# Altium project PCB_Project.PrjPcb (part 2 of 2)
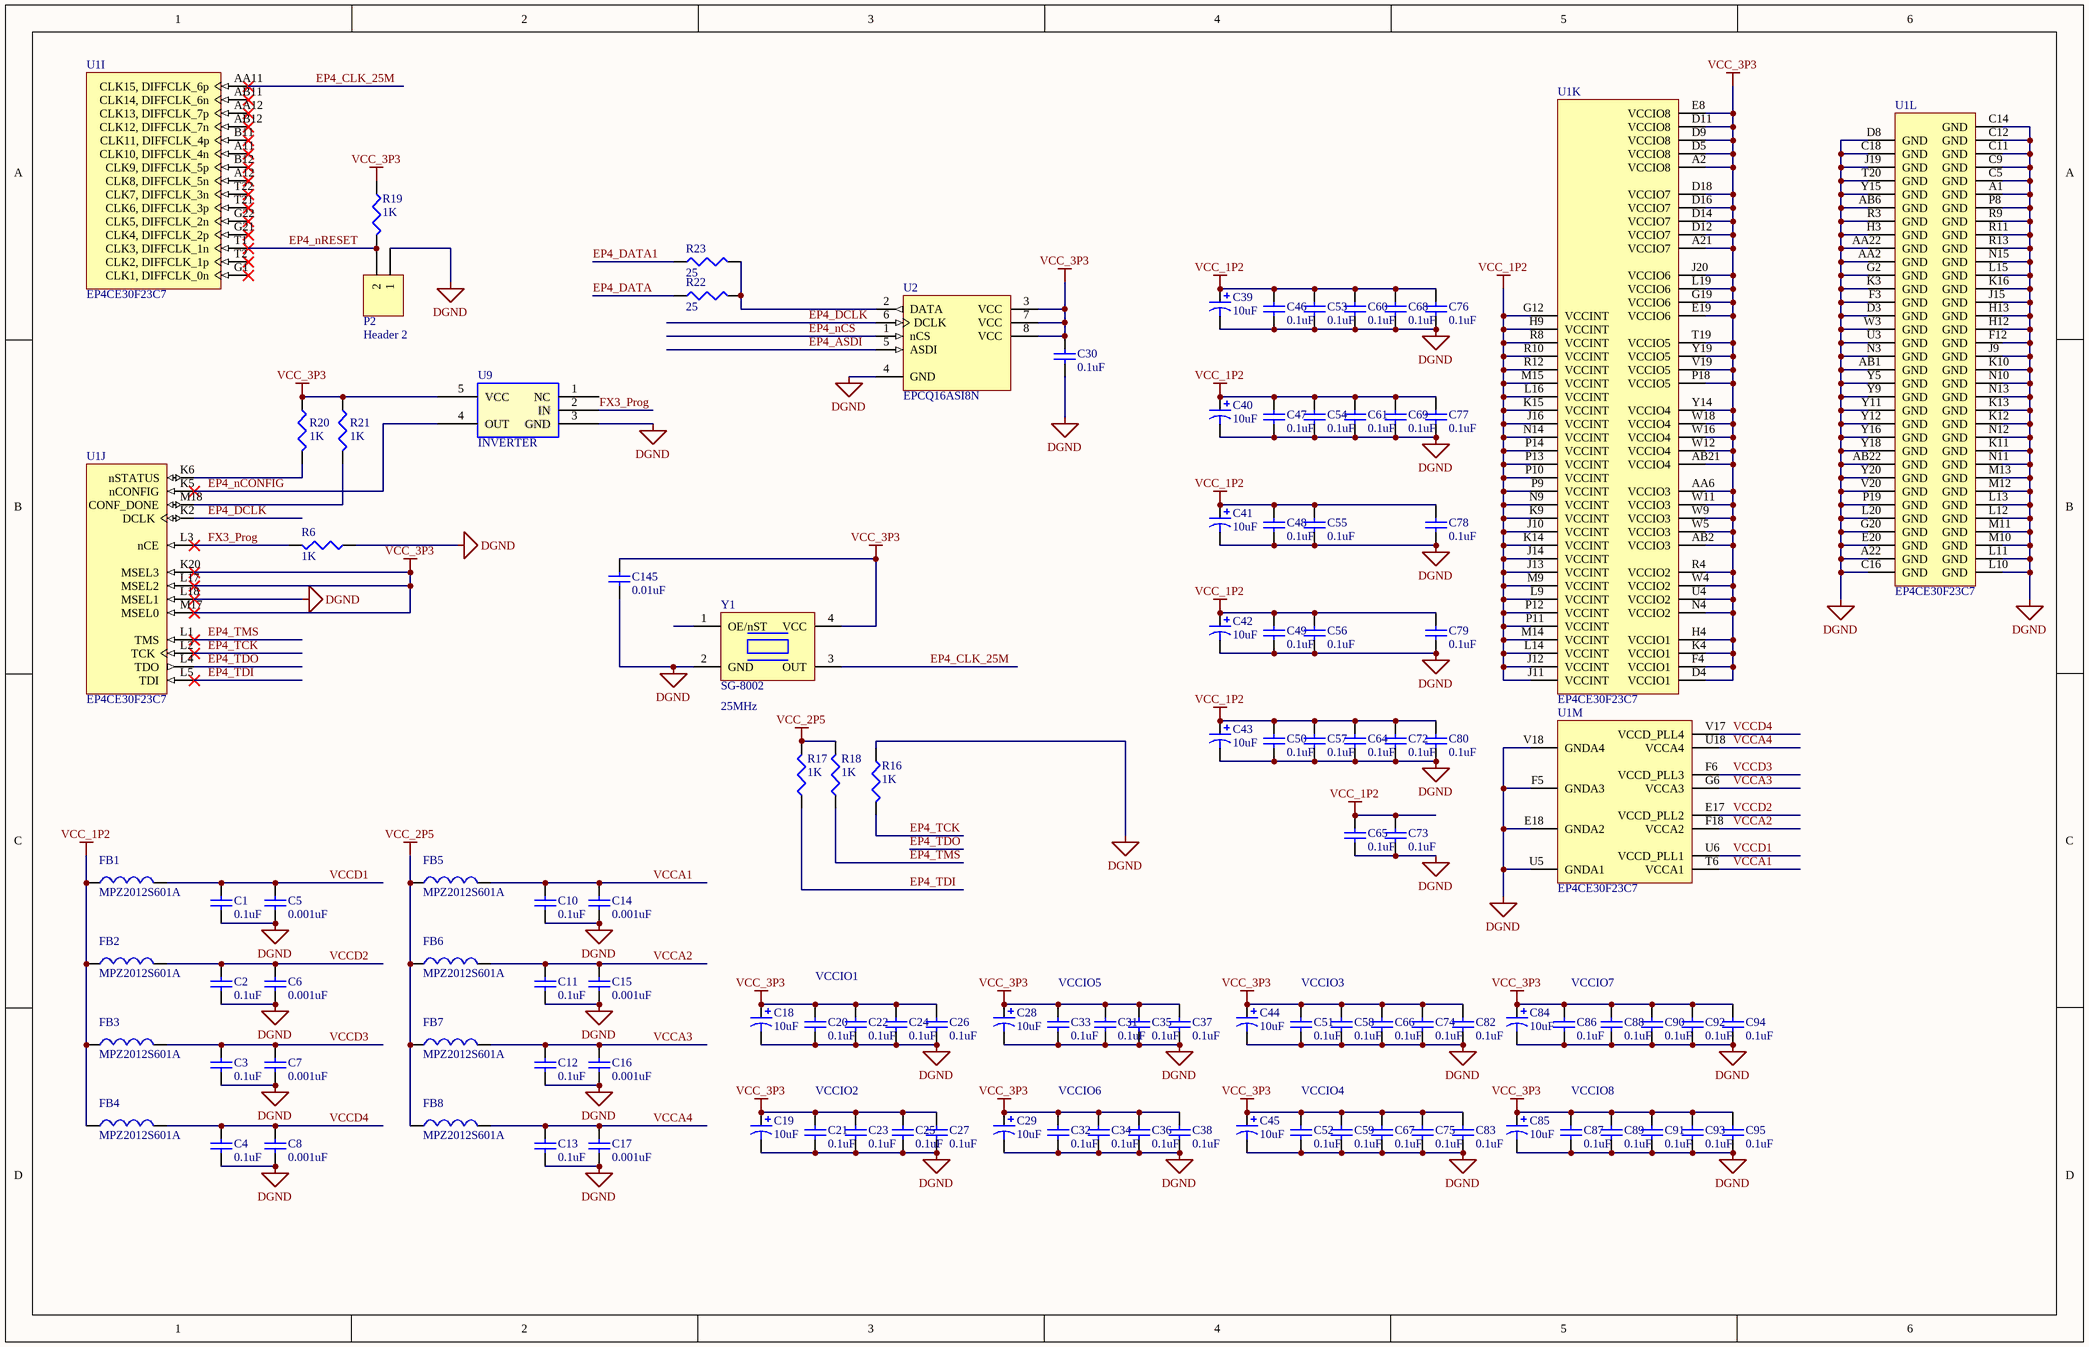
[diagram p6: ep4ce30_c.SchDoc]

## Nets that join several sheets
DGND: interface (51 pins), fx3_a (19 pins), fx3_b (51 pins), ep4ce30_c (168 pins)
VCC_1P2: interface (5 pins), fx3_b (21 pins), ep4ce30_c (60 pins)
VCC_2P5: interface (C251.1 J7.1 U27.5), ep4ce30_c (6 pins)
VCC_3P3: interface (24 pins), fx3_a (9 pins), fx3_b (24 pins), ep4ce30_c (93 pins)
VUSB: interface (P3.1), fx3_a (L1.2 U3.E11)
DIG_IN0: interface (U8.36), ep4ce30_b (U1.H21)
DIG_IN1: interface (U8.35), ep4ce30_b (U1.H22)
DIG_IN2: interface (U8.33), ep4ce30_b (U1.J21)
DIG_IN3: interface (U8.32), ep4ce30_b (U1.J22)
DIG_OUT0: interface (U8.47), ep4ce30_b (U1.C21)
DIG_OUT1: interface (U8.46), ep4ce30_b (U1.C22)
DIG_OUT2: interface (U8.44), ep4ce30_b (U1.D21)
DIG_OUT3: interface (U8.43), ep4ce30_b (U1.D22)
DIG_OUT4: interface (U8.41), ep4ce30_b (U1.E21)
DIG_OUT5: interface (U8.40), ep4ce30_b (U1.E22)
DIG_OUT6: interface (U8.38), ep4ce30_b (U1.F21)
DIG_OUT7: interface (U8.37), ep4ce30_b (U1.F22)
DIN0: interface (U8.26), ep4ce30_b (U1.L22)
DIN1: interface (U8.27), ep4ce30_b (U1.L21)
DIN2: interface (U8.29), ep4ce30_b (U1.K22)
DOUT0: interface (U7.47), ep4ce30_a (U1.AA17)
DOUT1: interface (U7.46), ep4ce30_a (U1.AB18)
DOUT2: interface (U7.44), ep4ce30_a (U1.AA18)
DOUT3: interface (U7.43), ep4ce30_a (U1.AB19)
DOUT4: interface (U7.40), ep4ce30_a (U1.AB20)
DOUT5: interface (U7.37), ep4ce30_b (U1.AA21)
DOUT6: interface (U7.35), ep4ce30_b (U1.Y21)
DOUT7: interface (U7.33), ep4ce30_b (U1.W22)
DOUT8: interface (U7.30), ep4ce30_b (U1.V22)
DOUT9: interface (U7.41), ep4ce30_a (U1.AA19)
DOUT10: interface (U7.38), ep4ce30_a (U1.AA20)
DOUT11: interface (U7.36), ep4ce30_b (U1.Y22)
DOUT12: interface (U7.32), ep4ce30_b (U1.W21)
DOUT13: interface (U7.27), ep4ce30_b (U1.U22)
DOUT14: interface (U7.29), ep4ce30_b (U1.V21)
Dserial: interface (U7.26), ep4ce30_b (U1.U21)
EP4_ASDI: fx3_a (U3.J2), ep4ce30_a (U1.D1), ep4ce30_c (U2.5)
EP4_DATA: ep4ce30_a (U1.K1), ep4ce30_c (R22.1)
EP4_DATA1: fx3_a (U3.K2), ep4ce30_c (R23.1)
EP4_DCLK: fx3_a (U3.J1), ep4ce30_c (U1.K2 U2.6)
EP4_nCS: fx3_a (U3.K1), ep4ce30_a (U1.E2), ep4ce30_c (U2.1)
EP4_SPI_MISO: fx3_a (U3.C2), ep4ce30_a (U1.AB16)
EP4_SPI_MOSI: fx3_a (U3.D5), ep4ce30_a (U1.W14)
EP4_SPI_nSS: fx3_a (U3.C1), ep4ce30_a (U1.AA16)
EP4_SPI_SCK: fx3_a (U3.D4), ep4ce30_a (U1.AA15)
FLASH_ALE: interface (U6.17), ep4ce30_b (U1.B17)
FLASH_CLE: interface (U6.16), ep4ce30_b (U1.A17)
FLASH_D0: interface (U6.29), ep4ce30_b (U1.A6)
FLASH_D1: interface (U6.30), ep4ce30_b (U1.B5)
FLASH_D2: interface (U6.31), ep4ce30_b (U1.A5)
FLASH_D3: interface (U6.32), ep4ce30_b (U1.B4)
FLASH_D4: interface (U6.41), ep4ce30_b (U1.A4)
FLASH_D5: interface (U6.42), ep4ce30_b (U1.B3)
FLASH_D6: interface (U6.43), ep4ce30_b (U1.A3)
FLASH_D7: interface (U6.44), ep4ce30_a (U1.B2)
FLASH_nCE: interface (U6.9), ep4ce30_b (U1.B18)
FLASH_nRB: interface (R44.1 U6.7), ep4ce30_b (U1.B19)
FLASH_nRE: interface (U6.8), ep4ce30_b (U1.A18)
FLASH_nWE: interface (U6.18), ep4ce30_b (U1.A16)
FLASH_nWP: interface (R45.1), ep4ce30_b (U1.A20)
FX3_Prog: fx3_a (U3.H2 U5.2), ep4ce30_c (R6.2 U1.L3 U9.2)
GPIF_CTL9: fx3_a (U3.H6), ep4ce30_a (U1.AA14)
GPIF_CTL10: fx3_a (U3.K5), ep4ce30_a (U1.AB14)
SLVFIFO_CLK: fx3_a (U3.J6), ep4ce30_a (U1.W13)
SLVFIFO_D0: fx3_a (U3.F10), ep4ce30_a (U1.W10)
SLVFIFO_D1: fx3_a (U3.F9), ep4ce30_a (U1.Y10)
SLVFIFO_D2: fx3_a (U3.F7), ep4ce30_a (U1.V13)
SLVFIFO_D3: fx3_a (U3.G10), ep4ce30_a (U1.AB9)
SLVFIFO_D4: fx3_a (U3.G9), ep4ce30_a (U1.AA10)
SLVFIFO_D5: fx3_a (U3.F8), ep4ce30_a (U1.Y13)
SLVFIFO_D6: fx3_a (U3.H10), ep4ce30_a (U1.W7)
SLVFIFO_D7: fx3_a (U3.H9), ep4ce30_a (U1.AB8)
SLVFIFO_D8: fx3_a (U3.J10), ep4ce30_a (U1.Y8)
SLVFIFO_D9: fx3_a (U3.J9), ep4ce30_a (U1.AA9)
SLVFIFO_D10: fx3_a (U3.K11), ep4ce30_a (U1.Y7)
SLVFIFO_D11: fx3_a (U3.L10), ep4ce30_a (U1.AB7)
SLVFIFO_D12: fx3_a (U3.K10), ep4ce30_a (U1.AA7)
SLVFIFO_D13: fx3_a (U3.K9), ep4ce30_a (U1.AA8)
SLVFIFO_D14: fx3_a (U3.J8), ep4ce30_a (U1.V11)
SLVFIFO_D15: fx3_a (U3.G8), ep4ce30_a (U1.AB10)
SLVFIFO_FLAGC: fx3_a (U3.K6), ep4ce30_a (U1.AB13)
SLVFIFO_nSLRD: fx3_a (U3.H7), ep4ce30_a (U1.V12)
START_WRITE: interface (U8.30), ep4ce30_b (U1.K21)
USB_BOOTMODE1: fx3_a (P1.2), ep4ce30_a (U1.W15)
USB_GPIO45: fx3_a (U3.F2), ep4ce30_a (U1.AB15)
USB_nRESET: fx3_a (U5.1), ep4ce30_a (U1.AB17)
USER_nLED0: interface (D1.2), ep4ce30_a (U1.C1)
USER_nLED1: interface (D2.2), ep4ce30_a (U1.C2)
USER_nLED2: interface (D3.2), ep4ce30_a (U1.B1)